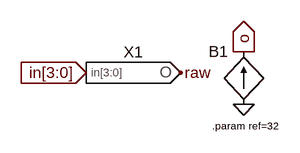
[diagram p0: schematic dac-signed-5bit-fast.asc]
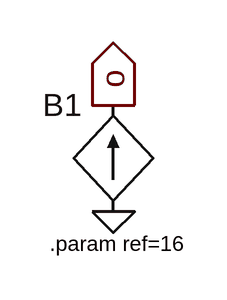
[diagram p1: sub-circuit dac-4bit-fast.asc]
dac-signed-5bit-fast.asc, the LTspice schematic file:
Version 4
SHEET 1 880 680
FLAG 224 -48 o
IOPIN 224 -48 Out
FLAG 224 32 0
FLAG -16 -16 in[3:0]
IOPIN -16 -16 In
FLAG 128 -16 raw
SYMBOL bi 224 32 R180
WINDOW 0 24 80 Left 2
WINDOW 3 24 0 Invisible 0
SYMATTR InstName B1
SYMATTR Value I=IF(V(in[4]),V(raw)-16,V(raw))
SYMATTR Value2 Rpar={ref/32}
SYMBOL dac-4bit-fast 48 -16 R0
SYMATTR InstName X1
TEXT 176 64 Left 1 !.param ref=32

dac-4bit-fast.asc, the sub-circuit schematic file:
Version 4
SHEET 1 880 680
FLAG 224 -48 o
IOPIN 224 -48 Out
FLAG 224 32 0
SYMBOL bi 224 32 R180
WINDOW 0 24 80 Left 2
WINDOW 3 24 0 Invisible 0
SYMATTR InstName B1
SYMATTR Value I=8*V(in[3])+4*V(in[2])+2*V(in[1])+V(in[0])
SYMATTR Value2 Rpar={ref/16}
TEXT 176 56 Left 1 !.param ref=16

The netlist it stands for:
* dac-signed-5bit-fast.asc
B1 0 o I=IF(V(in[4]),V(raw)-16,V(raw)) Rpar={ref/32}
XX1 in[3] in[2] in[1] in[0] raw dac-4bit-fast

* block symbol definitions
.subckt dac-4bit-fast in[3] in[2] in[1] in[0] o
B1 0 o I=8*V(in[3])+4*V(in[2])+2*V(in[1])+V(in[0]) Rpar={ref/16}
.param ref=16
.ends dac-4bit-fast

.param ref=32
.backanno
.end